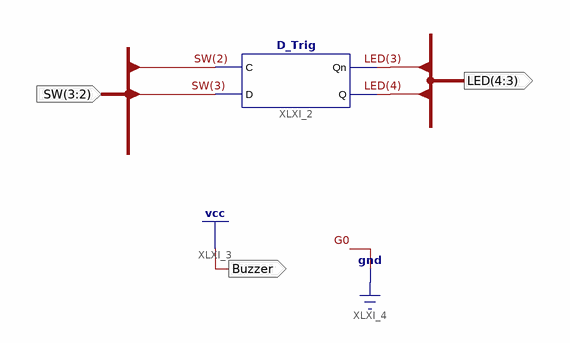
[diagram p0: schematic sheet 1]
// Xilinx ISE schematic Top_D_Trig.sch (kintex7) as structural Verilog: 1 symbols, 3 ports
module Top_D_Trig (
  input  [3:2] SW,
  output [4:3] LED,
  output Buzzer
);

  D_Trig XLXI_2 (.C(SW[2]), .D(SW[3]), .Qn(LED[3]), .Q(LED[4]));

  assign Buzzer = 1'b1;
endmodule
